# Altium project berry_case_altium.PrjPcb
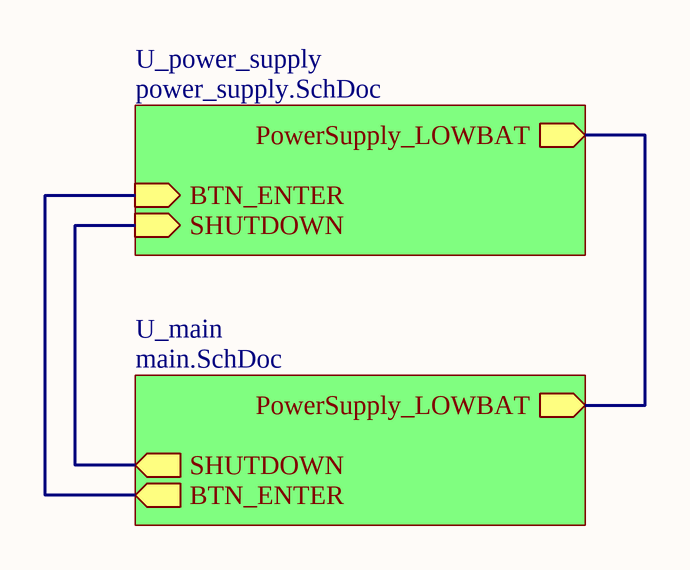
[diagram p0: sheets_entries.SchDoc]
3 sheets, 23 parts. Net scope: hierarchical (ports join the sheet entries above them; power ports are global).
Board files: pcb.PcbDoc, pcb_top.PcbDoc
Sheets:
  sheets_entries.SchDoc
    U_power_supply = power_supply.SchDoc
    U_main = main.SchDoc

## Sheet sheets_entries.SchDoc
size A

### Sub-sheets
U_main = main.SchDoc: PowerSupply_LOWBAT (out), SHUTDOWN (out), BTN_ENTER (out)
U_power_supply = power_supply.SchDoc: SHUTDOWN (in), BTN_ENTER (in), PowerSupply_LOWBAT (out)

### Nets
SW1_ENTER: sheet U_power_supply/BTN_ENTER, sheet U_main/BTN_ENTER
NetBRD1_6: sheet U_power_supply/PowerSupply_LOWBAT, sheet U_main/PowerSupply_LOWBAT
NetJ3_22: sheet U_power_supply/SHUTDOWN, sheet U_main/SHUTDOWN

## Sheet power_supply.SchDoc
size A
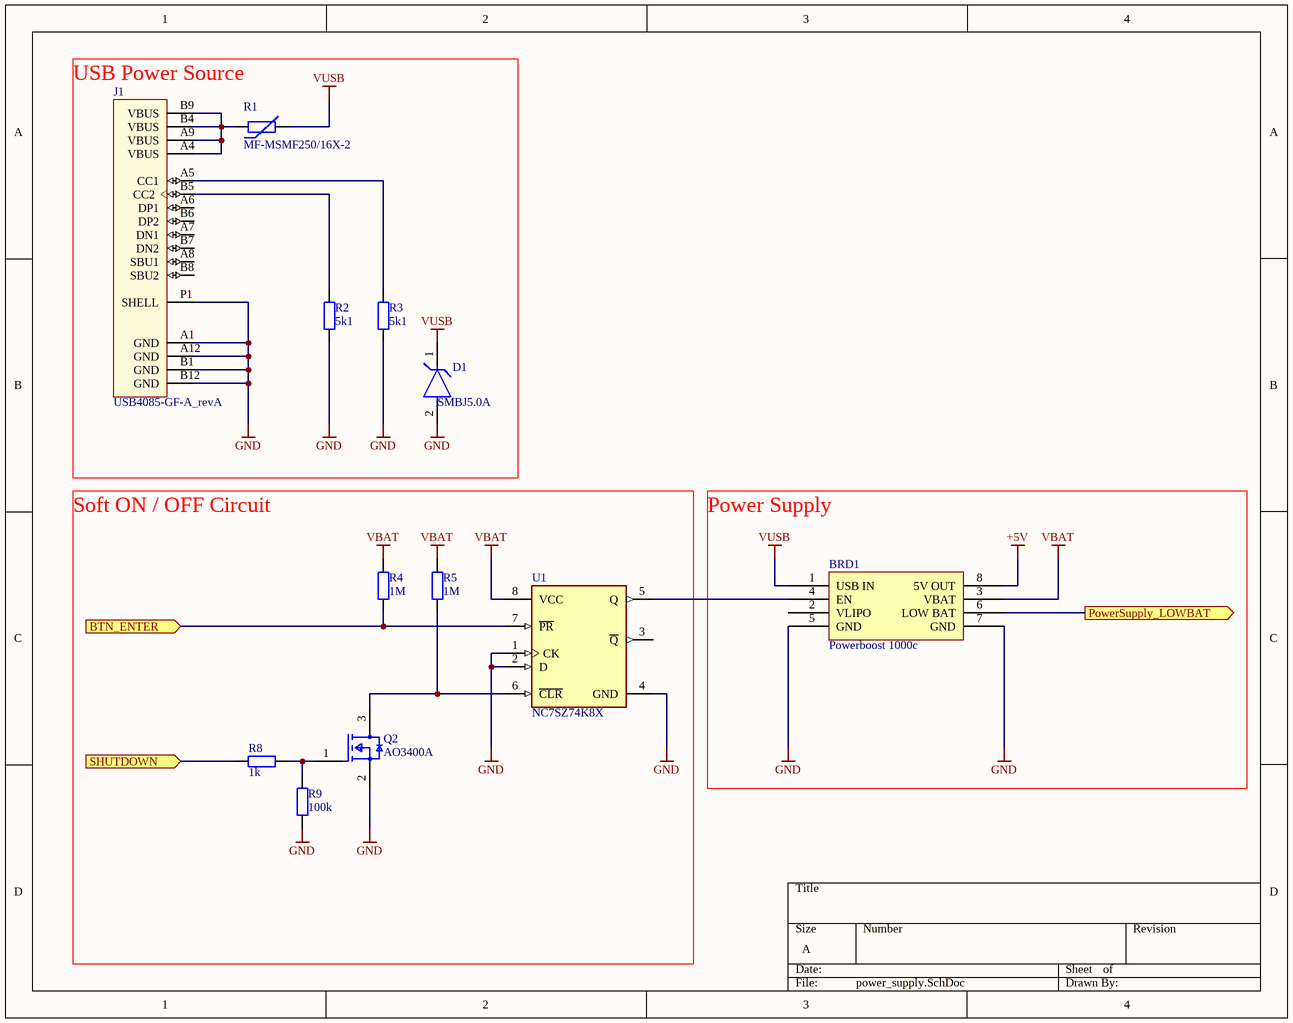
[diagram p1: power_supply.SchDoc]

### Parts
BRD1  Powerboost 1000c  [POWERBOOST_1000C]
D1  SMBJ5.0A  [FP-SMBJ-MFG]
J1  USB4085-GF-A_revA  [GCT_USB4085-GF-A_REVA]
Q2  AO3400A  [SOT23]
R1  MF-MSMF250/16X-2  [Res_1812]
R2  value 5k1  [RESC2013X50X30NL20T20]  (hidden comment: Res_0805)
R3  value 5k1  [RESC2013X50X30NL20T20]  (hidden comment: Res_0805)
R4  value 1M  [RESC2013X50X30NL20T20]  (hidden comment: Res_0805)
R5  value 1M  [RESC2013X50X30NL20T20]  (hidden comment: Res_0805)
R8  value 1k  [RESC2013X50X30NL20T20]  (hidden comment: Res_0805)
R9  value 100k  [RESC2013X50X30NL20T20]  (hidden comment: Res_0805)
U1  NC7SZ74K8X  [FP-846AN-MFG]

### Ports
BTN_ENTER (in), PowerSupply_LOWBAT (out), SHUTDOWN (in)

### Nets
+5V: BRD1.8(5V_OUT)
GND: BRD1.5(GND) BRD1.7(GND) D1.2(A) J1.A1(GND) J1.A12(GND) J1.B1(GND) J1.B12(GND) J1.P1(SHELL) Q2.2(S) R2.1 R3.1 R9.1 U1.1(CK) U1.2(D) U1.4(GND)
VBAT: BRD1.3(VBAT) R4.2 R5.2 U1.8(VCC)
VUSB: BRD1.1(USB_IN) D1.1(C) R1.2
SW1_ENTER: R4.1 U1.7(~{PR}) ; port BTN_ENTER
NetBRD1_4: BRD1.4(EN) U1.5(Q)
NetBRD1_6: BRD1.6(LOW_BAT) ; port PowerSupply_LOWBAT
NetJ1_A4: J1.A4(VBUS) J1.A9(VBUS) J1.B4(VBUS) J1.B9(VBUS) R1.1
NetJ1_A5: J1.A5(CC1) R3.2
NetJ1_B5: J1.B5(CC2) R2.2
NetJ3_22: R8.1 ; port SHUTDOWN
NetQ2_1: Q2.1(G) R8.2 R9.2
NetQ2_3: Q2.3(D) R5.1 U1.6(~{CLR})

Not connected (* = marked no-connect by the designer): BRD1 2(VLIPO); J1 A6(DP1) A7(DN1) A8(SBU1) B6(DP2) B7(DN2) B8(SBU2); U1 3(~{Q})

### Notes on the sheet
- USB Power Source
- (near BRD1) Power Supply
- Soft ON / OFF Circuit

### Library data of the parts
BRD1 = Powerboost_1000c: BOARD PWRBOOST1000 5V LIPO USB; Manufacturer: Adafruit Industries; Manufacturer Part Number: 2465; Evaluation Kit: Yes; Output Voltage: 5.2V; Output Current: 1A; Switching Frequency: 700kHz; Supplier 1: Digi-Key; RoHS: No; Category: Embedded Processors and Controllers; Stock 1: 834; Pricing 1: 1=19.95000 (USD); Package Quantity: 1; ComponentLink1URL: https://media.digikey.com/pdf/Data%20Sheets/Adafruit%20PDFs/2465_Web.pdf?src-supplier=Digi-Key; ComponentLink1Description: https://media.digikey.com/pdf/Data%20Sheets/Adafruit%20PDFs/2465_Web.pdf?src-supplier=Digi-Key; Supplier Part Number 1: 1528-1349-ND
D1 = CMP-08607-000042-1: TVS DIODE 5V 9.2V DO214AA; Manufacturer: Littelfuse Inc; Breakdown Voltage: 6.4V; Direction: Unidirectional; Peak Pulse Current: 65.3A; Max Junction Temp: +150°C; Number Of Channels: 1; Peak Pulse Power: 600W; Clamping Voltage: 9.2V; Octopart: https://octopart.com/smbj5.0a-littelfuse-8835; Package: SMBJ; RoHS: TRUE; Temperature Range Low: -65°C; Device Class L2: TVS Diodes; Automotive: No; ComponentLink2URL: https://www.littelfuse.com/~/media/electronics/datasheets/tvs_diodes/littelfuse_tvs_diode_smbj_datasheet.pdf.pdf; Height: 2.61mm; ComponentLink2Description: Datasheet; Temperature: -65°C to +150°C; Category: Diode; Temperature Range High: +150°C; Lead Free: Yes; Digikey Description: TVS DIODE 5V 9.2V DO214AA; Device Class L1: Circuit Protection; Reverse Standoff Voltage: 5V; Device Class L3: unset; Manufacturer Part Number: SMBJ5.0A; Mouser Description: TVSS; Diode; For Data/Comm; Industrial Equip; 65.3A; SMD; Solder Term; Clamp-V 9.2V
J1 = USB-C port: USB 2.0 Type C Receptacle Dip Type, PCB Top Mount; MANUFACTURER: Global Connector Technology; PARTREV: A; STANDARD: Manufacturer Recommendations
Q2 = MOSFET_AO3400A: MOSFET N-CH 30V 5.7A SOT23; Input Capacitance: 630pF; Number of Elements: 1; Rds On Max: 26.5mR; Max Power Dissipation: 1.4W; Gate to Source Voltage (Vgs): 12V; Min Operating Temperature: -55°C; Lead Free: Lead Free; Number of Pins: 3; Drain to Source Voltage (Vdss): 30V; Case/Package: SOT-23; Mount: Surface Mount; Continuous Drain Current (ID): 5.7A; Radiation Hardening: No; Packaging: Tape and Reel; Max Operating Temperature: 150°C; Power Dissipation: 1.4W
R1 = PTC Fuse: PTC Resettable Fuse 2.5A(hold) 5A(trip) 16V 100A 1.2W 5s 0.015Ohm SMD Solder Pad 1812 T/R; Manufacturer: Bourns; Number of Terminals/Pins: 2; Resistance: 100mR; Approvals: UL,CSA,TUV; Supplier 1: Digi-Key; RoHS: Yes; Category: Fuses; Stock 1: 33109; Pricing 1: 1=0.54000, 5=0.52000, 10=0.50400, 50=0.42400, 100=0.35200, 250=0.32000, 500=0.27200 (USD); Mount: Surface Mount,PCB; Case/Package: 1812; Case Code (Imperial): 1812; Case Code (Metric): 4532; Contact Plating: Gold; Min Operating Temperature: -40°C; Max Operating Temperature: 85°C; Hold Current: 2.5A; Trip Current: 5A; Max Current Rating: 100A; Power Dissipation: 1.2W; Current Rating: 100A; Time to Trip: 5s; Package Quantity: 1500; Packaging: Tape and Reel; Voltage Rating: 16V; Voltage Rating (DC): 16V; Termination: SMD/SMT; Length: 4.73mm; Width: 3.41mm; Height: 1.6mm; Radiation Hardening: No; REACH SVHC: No SVHC; ComponentLink1URL: https://datasheet.ciiva.com/3020/mfmsmf-3020420.pdf?src-supplier=Avnet; ComponentLink1Description: https://datasheet.ciiva.com/3020/mfmsmf-3020420.pdf?src-supplier=Avnet; ComponentLink2URL: https://datasheet.ciiva.com/16206/mfmsmf-16206071.pdf?src-supplier=Onlinecomponents.com; ComponentLink2Description: https://datasheet.ciiva.com/16206/mfmsmf-16206071.pdf?src-supplier=Onlinecomponents.com; ComponentLink3URL: https://datasheet.ciiva.com/7434/mfmsmf-7434296.pdf?src-supplier=Digi-Key; ComponentLink3Description: https://datasheet.ciiva.com/7434/mfmsmf-7434296.pdf?src-supplier=Digi-Key; ComponentLink4URL: https://datasheet.ciiva.com/32430/mf-msmf-series-eng-tds-32430600.pdf?src-supplier=Distrelec; ComponentLink4Description: https://datasheet.ciiva.com/32430/mf-msmf-series-eng-tds-32430600.pdf?src-supplier=Distrelec; ComponentLink5URL: https://datasheet.ciiva.com/7434/mfmsmf-7434298.pdf?src-supplier=Digi-Key; ComponentLink5Description: https://datasheet.ciiva.com/7434/mfmsmf-7434298.pdf?src-supplier=Digi-Key; ComponentLink6URL: https://datasheet.ciiva.com/16692/mfmsmf-16692202.pdf?src-supplier=Avnet+Europe; ComponentLink6Description: https://datasheet.ciiva.com/16692/mfmsmf-16692202.pdf?src-supplier=Avnet+Europe; ComponentLink7URL: https://datasheet.ciiva.com/30088/575mfmsmf-30088346.pdf?src-supplier=Onlinecomponents.com; ComponentLink7Description: https://datasheet.ciiva.com/30088/575mfmsmf-30088346.pdf?src-supplier=Onlinecomponents.com; ComponentLink8URL: https://datasheet.ciiva.com/7434/mfmsmf-7434299.pdf?src-supplier=Digi-Key; ComponentLink8Description: https://datasheet.ciiva.com/7434/mfmsmf-7434299.pdf?src-supplier=Digi-Key; ComponentLink9URL: https://datasheet.ciiva.com/14538/70153434-14538955.pdf?src-supplier=Allied+Electronics; ComponentLink9Description: https://datasheet.ciiva.com/14538/70153434-14538955.pdf?src-supplier=Allied+Electronics; ComponentLink10URL: https://datasheet.ciiva.com/8005/1786007-8005325.pdf?src-supplier=Element14; ComponentLink10Description: https://datasheet.ciiva.com/8005/1786007-8005325.pdf?src-supplier=Element14; ComponentLink11URL: https://datasheet.ciiva.com/48700/001055646-da-01-en-sich-ptc-reset-mf-msmf250-16x-2-2-5a16v-48700197.pdf?src-supplier=Conrad; ComponentLink11Description: https://datasheet.ciiva.com/48700/001055646-da-01-en-sich-ptc-reset-mf-msmf250-16x-2-2-5a16v-48700197.pdf?src-supplier=Conrad; Supplier Part Number 1: MF-MSMF250/16X-2CT-ND; Manufacturer Part Number: MF-MSMF250/16X-2
R2-R5 R8 R9 = Res_0805: Resistor; Tolerance: 1%; Power Rating: 125mW
U1 = CMP-07113-000002-1: IC FF D-TYPE SNGL 1BIT US8; Manufacturer: ON Semiconductor; Frequency: 250MHz; Number Of Outputs: 2; Number Of Circuits: 1; Max Supply Voltage: 5.5V; Min Supply Voltage: 1.65V; Logic Function Desc: Non-inverting; Standoff Height: 0mm; Max Junction Temp: +150°C; Propagation Delay: 2.6ns; Quiescent Current: 1uA; Lead Free: Yes; Digikey Description: IC FF D-TYPE SNGL 1BIT US8; ComponentLink2Description: Datasheet; Temperature Range High: +150°C; Ambient Temperature Range Low: -40°C; Manufacturer Part Number: NC7SZ74K8X; Octopart: https://octopart.com/nc7sz74k8x-on+semiconductor-84330810; Ambient Temperature Range High: +85°C; Device Class L3: Latches and Flip Flops; ComponentLink2URL: https://www.onsemi.com/pub/Collateral/NC7SZ74-D.PDF; Device Class L1: Integrated Circuits (ICs); Mouser Description: Flip Flops TinyLogic UHS D-Type; Device Class L2: Logic ICs; Ipc Land Pattern Name: SOP50P200X90-8; Height: 0.9mm; RoHS: TRUE; Category: IC; Temperature: to +150°C; Automotive: No; Number Of Inputs: 1; Package: 846AN; Footprint Url: https://www.onsemi.com/pub/Collateral/846AN.PDF

## Sheet main.SchDoc
size A
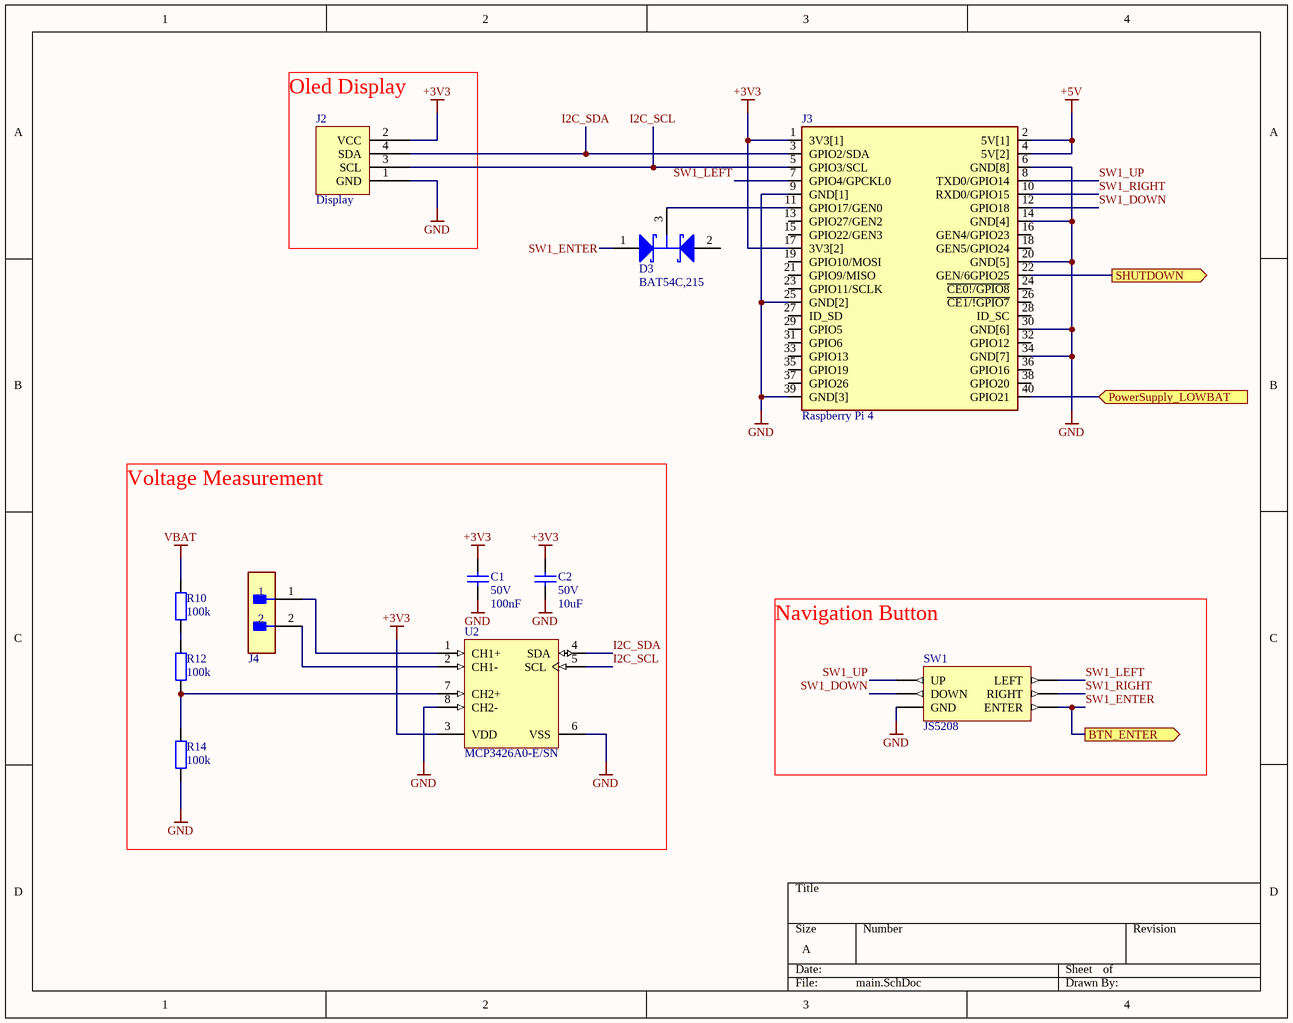
[diagram p2: main.SchDoc]

### Parts
C1  value 100nF  Voltage Rating: 50V  [CAPC2013X88X50NL20T25]  (hidden comment: Cap_0805)
C2  value 10uF  Voltage Rating: 50V  [CAPC2013X88X50NL20T25]  (hidden comment: Cap_0805)
D3  BAT54C,215  [SOT23]
J2  Display  [OLED_DISPLAY]
J3  Raspberry Pi 4  [RASPBERRY_PI_4]
J4  ADC_header  [ADC_HEADER]  (value not drawn)
R10  value 100k  [RESC2013X50X30NL20T20]  (hidden comment: Res_0805)
R12  value 100k  [RESC2013X50X30NL20T20]  (hidden comment: Res_0805)
R14  value 100k  [RESC2013X50X30NL20T20]  (hidden comment: Res_0805)
SW1  JS5208  [JS5208_PKG]
U2  MCP3426A0-E/SN  [SOIC-SN8_L]

### Ports
BTN_ENTER (out), PowerSupply_LOWBAT (in), SHUTDOWN (out)

### Nets
+3V3: C1.2 C2.2 J2.2(VCC) J3.1(3V3[1]) J3.17(3V3[2]) U2.3(VDD)
+5V: J3.2(5V[1]) J3.4(5V[2])
GND: C1.1 C2.1 J2.1(GND) J3.6(GND[8]) J3.9(GND[1]) J3.14(GND[4]) J3.20(GND[5]) J3.25(GND[2]) J3.30(GND[6]) J3.34(GND[7]) J3.39(GND[3]) R14.1 SW1.COM(GND) U2.6(VSS) U2.8(CH2-)
VBAT: R10.2
I2C_SCL: J2.3(SCL) J3.5(GPIO3/SCL) U2.5(SCL)
I2C_SDA: J2.4(SDA) J3.3(GPIO2/SDA) U2.4(SDA)
SW1_DOWN: J3.12(GPIO18) SW1.C-D(DOWN)
SW1_ENTER: D3.1(A) SW1.E-BTN(ENTER) ; port BTN_ENTER
SW1_LEFT: J3.7(GPIO4/GPCKL0) SW1.B-L(LEFT)
SW1_RIGHT: J3.10(RXD0/GPIO15) SW1.D-R(RIGHT)
SW1_UP: J3.8(TXD0/GPIO14) SW1.A-U(UP)
NetBRD1_6: J3.40(GPIO21) ; port PowerSupply_LOWBAT
NetD3_3: D3.3(K) J3.11(GPIO17/GEN0)
NetJ3_22: J3.22(GEN/6GPIO25) ; port SHUTDOWN
NetJ4_1: J4.1 U2.1(CH1+)
NetJ4_2: J4.2 U2.2(CH1-)
NetR10_1: R10.1 R12.2
NetR12_1: R12.1 R14.2 U2.7(CH2+)

Not connected (* = marked no-connect by the designer): D3 2(A); J3 13(GPIO27/GEN2) 15(GPIO22/GEN3) 16(GEN4/GPIO23) 18(GEN5/GPIO24) 19(GPIO10/MOSI) 21(GPIO9/MISO) 23(GPIO11/SCLK) 24(~{CE0!/GPIO8}) 26(~{CE1/!GPIO7}) 27(ID_SD) 28(ID_SC) 29(GPIO5) 31(GPIO6) 32(GPIO12) 33(GPIO13) 35(GPIO19) 36(GPIO16) 37(GPIO26) 38(GPIO20)

### Notes on the sheet
- (near J2) Oled Display
- (near SW1) Navigation Button
- Voltage Measurement

### Library data of the parts
C1 C2 = Cap_0805: Ceramic Capacitor X7R
D3 = DIODE_BAT54C: Schottky Barrier Diode, 30 V, 3-Pin SOT23, RoHS, Tape and Reel; Manufacturer: NXP Semiconductors; Forward Surge Current Ifsm Max: 600mA; Pin Configuration: 1A1,2A2,3comK; Package Version: Feb-16; Forward Voltage VF Max: 800mV; SMD Marking: L43/*W1; Diode Case Style: SOT-23; Reverse Recovery Time trr Typ: 5ns; Forward Current If(AV): 200mA; Reel Quantity: 3000; SVHC: NoSVHC(19-Dec-2012); No. of Pins: 3; Junction Temperature Tj Max: 125degC; Common Connection: Cathode; Repetitive Reverse Voltage Vrrm Max: 30V; Operating Temperature Max: 150degC; Operating Temperature Range: -65degCto+150degC; Termination Type: SMD; Package Description: 3-Pin Small Outline Transistor, Body 1.3 x 2.9 mm, Pitch 0.95 mm; Package / Case: SOT-23; Diode Type: Schottky; Manufacturer URL: http://www.nxp.com/; Tape Width: 8mm; Package Reference: SOT23-3; Datasheet URL: https://datasheet.ciiva.com/33723/1668625-33723936.pdf; Datasheet Version: Rev. 5 , 10/2012; Operating Temperature Min: -65degC; Current Ifsm: 600mA; Reverse Recovery Time trr Max: 5ns; Package URL: http://www.nxp.com/documents/outline_drawing/SOT23.pdf; Forward Voltage: 800mV
J2 = Oled Display: Tiger Claw(TM) Socket Strip, Through-hole, Vertical, -55 to 105 degC, 2 mm Pitch, 4-Pin, Female, RoHS; Manufacturer: Samtec; PartNumber: MMS-104-01-T-SV; Pitch: 2 mm; PackageDescription: 2mm Through Hole Box Connector Strip Assembly; DatasheetVersion: F-214; ComponentLink1URL: http://www.samtec.com; RoHS: True; Temperature Range: -55 to 105 degC; ComponentLink1Description: Manufacturer URL; Mounting Technology: Through-hole; ComponentLink2Description: Datasheet; Orientation: Vertical; ComponentLink2URL: http://www.samtec.com/documents/webfiles/pdf/MMS.PDF; ComponentLink3Description: Package Specification; ComponentLink3URL: http://www.samtec.com/documents/webfiles/cpdf/MMS-1XX-01-XXX-XX-XXX-MKT1.pdf; PackageVersion: AO, 2/1993; PackageReference: MMS-104-01-X-SV
J3 = RASPBERRY_PI4: Raspberry Pi 4 with Headers_; MP: ADA3708; Availability: Unavailable; Package: None; MF: Raspberry Pi; Value: *; Price: None; SnapEDA_Link: https://www.snapeda.com/parts/ADA3708/Raspberry%20Pi/view-part/2770118/?ref=snap
R10 R12 R14 = Res_0805: as R2 on sheet power_supply
SW1 = NAV_BUTTON: E-SWITCH - JS5208 - SWITCH, NAVIGATION, 5 POSITION, 20mA, SMD; Mechanical Life: 100000Cycles; Voltage Rating (DC): 15V; Operating Force: 500gf; Supplier 1: Digi-Key; Manufacturer: E-Switch; RoHS: Yes; Category: Switches; Stock 1: 2460; Pricing 1: 1=2.49000, 5=2.43200, 10=2.04400, 25=1.93360, 50=1.82320, 100=1.65750 (USD); Mount: Surface Mount; Number of Pins: 5; Contact Material: Silver; Min Operating Temperature: -20°C; Max Operating Temperature: 70°C; Termination: Gull Wing; Electrical Life: 100000Cycles; Current Rating: 20mA; Package Quantity: 300; Lead Free: Lead Free; REACH SVHC: No SVHC; ComponentLink1URL: https://datasheet.ciiva.com/1530/js5208-1530917.pdf?src-supplier=Element14; ComponentLink1Description: https://datasheet.ciiva.com/1530/js5208-1530917.pdf?src-supplier=Element14; ComponentLink2URL: https://datasheet.ciiva.com/12447/js5208-19824-12447191.pdf?src-supplier=Mouser; ComponentLink2Description: https://datasheet.ciiva.com/12447/js5208-19824-12447191.pdf?src-supplier=Mouser; ComponentLink3URL: https://datasheet.ciiva.com/2869/p200020c-2869289.pdf?src-supplier=Digi-Key; ComponentLink3Description: https://datasheet.ciiva.com/2869/p200020c-2869289.pdf?src-supplier=Digi-Key; ComponentLink4URL: https://datasheet.ciiva.com/16360/js5208-16360789.pdf?src-supplier=Future+Electronics; ComponentLink4Description: https://datasheet.ciiva.com/16360/js5208-16360789.pdf?src-supplier=Future+Electronics; Supplier Part Number 1: EG4561-ND; Manufacturer Part Number: JS5208
U2 = CMP-0188-01151-1: 16-Bit, Multi-Channel Delta-Sigma Analog-to-Digital Converter with I2C Interface and On-Board Reference, 8-Pin SOIC 150mil, Extended Temperature; ComponentLink2Description: Datasheet; ComponentLink3Description: Package Specification; PackageVersion: revBB, Aug-2009; Code_JEDEC: MS-012; Code_IPC: SOIC127P600-8; PackageDescription: 8-Lead Plastic Small Outline (SN) - Narrow, 3.90mm Body [SOIC]; ComponentLink1Description: Manufacturer URL; ComponentLink2URL: http://ww1.microchip.com/downloads/en/DeviceDoc/22226a.pdf; ComponentLink1URL: http://www.microchip.com/; DatasheetVersion: revA, Dec-2009; ComponentLink3URL: http://www.microchip.com/stellent/groups/techpub_sg/documents/packagingspec/en012702.pdf; PackageReference: SOIC-SN8

## Nets that join several sheets
+5V: power_supply (BRD1.8), main (J3.2 J3.4)
GND: power_supply (15 pins), main (15 pins)
VBAT: power_supply (BRD1.3 R4.2 R5.2 U1.8), main (R10.2)
NetBRD1_6: power_supply (BRD1.6), main (J3.40)
NetJ3_22: power_supply (R8.1), main (J3.22)
SW1_ENTER: power_supply (R4.1 U1.7), main (D3.1 SW1.E-BTN)